# Altium schematic sheet SPI-Flash.SchDoc
size A4
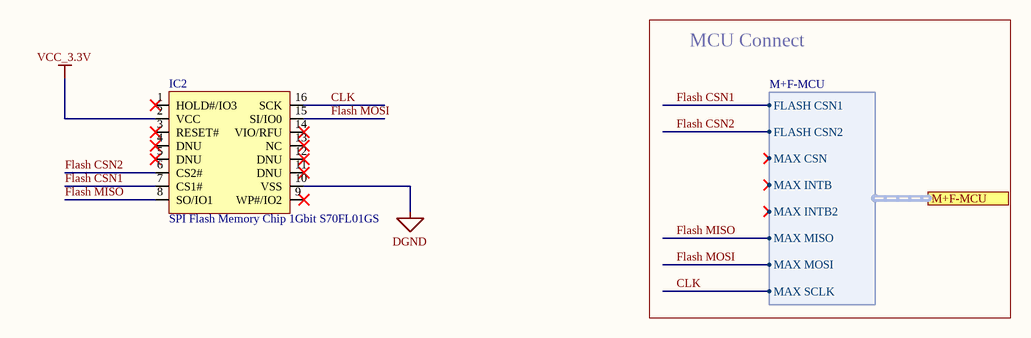
[diagram p0: SPI-Flash.SchDoc]

## Parts
IC2  SPI Flash Memory Chip 1Gbit S70FL01GS  [S70FL01GS]

## Ports
M+F-MCU (harness M+F-MCU)

## Harnesses
M+F-MCU: FLASH CSN1, FLASH CSN2, MAX CSN, MAX INTB, MAX INTB2, MAX MISO, MAX MOSI, MAX SCLK

## Nets
DGND: IC2.10(VSS)
VCC_3.3V: IC2.2(VCC)
CLK: IC2.16(SCK) ; port M+F-MCU.MAX SCLK
Flash CSN1: IC2.7(CS1#) ; port M+F-MCU.FLASH CSN1
Flash CSN2: IC2.6(CS2#) ; port M+F-MCU.FLASH CSN2
Flash MISO: IC2.8(SO/IO1) ; port M+F-MCU.MAX MISO
Flash MOSI: IC2.15(SI/IO0) ; port M+F-MCU.MAX MOSI

Not connected (* = marked no-connect by the designer): IC2 1(HOLD#/IO3)* 3(RESET#)* 4(DNU)* 5(DNU)* 9(WP#/IO2)* 11(DNU)* 12(DNU)* 13(NC)* 14(VIO/RFU)*

## Notes on the sheet
- MCU Connect